# Altium project STM32.PrjPcb
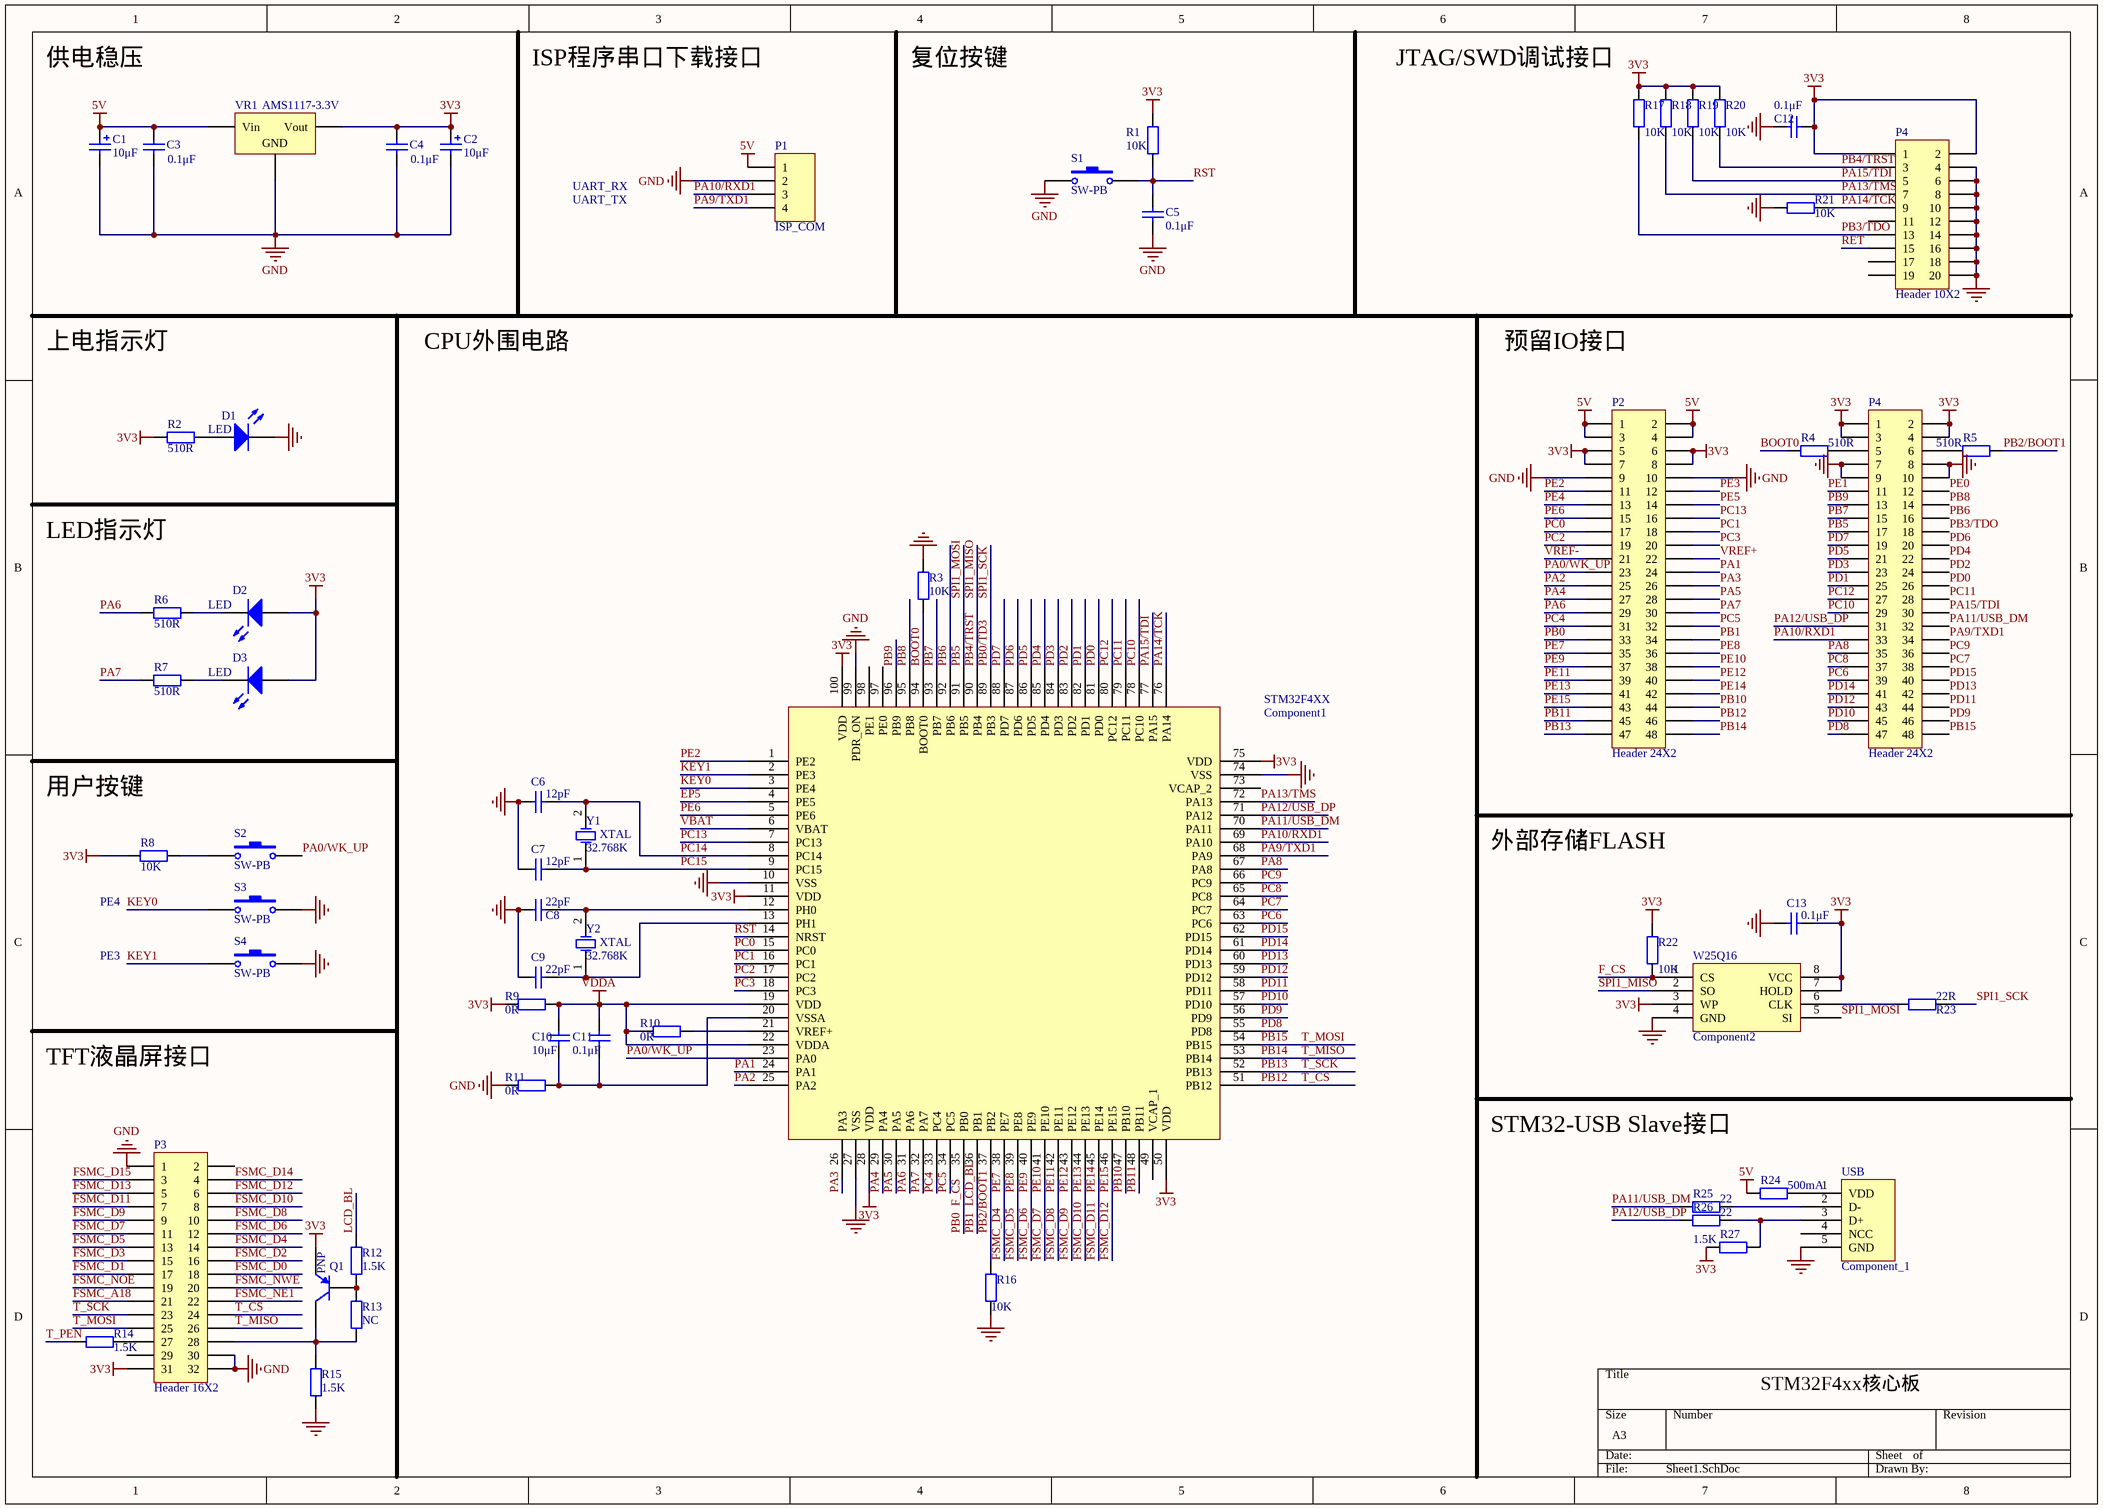
[diagram p0: Sheet1.SchDoc]
1 sheet, 59 parts. Net scope: global (net labels, ports and power ports of the same name join across sheets).
Board file: PCB1.PcbDoc

## Sheet Sheet1.SchDoc
size A3

### Parts
(Parts that share a designator on the sheet are numbered #1, #2 ... from top to bottom, then left to right.)
C1  value 10μF  [6-0805_M]  (hidden comment: Cap Pol2)
C2  value 10μF  [6-0805_M]  (hidden comment: Cap Pol2)
C3  value 0.1μF  [6-0805_M]  (hidden comment: Cap)
C4  value 0.1μF  [6-0805_M]  (hidden comment: Cap)
C5  value 0.1μF  [6-0805_M]  (hidden comment: Cap)
C6  value 12pF  [6-0805_M]  (hidden comment: Cap)
C7  value 12pF  [6-0805_M]  (hidden comment: Cap)
C8  value 22pF  [6-0805_M]  (hidden comment: Cap)
C9  value 22pF  [6-0805_M]  (hidden comment: Cap)
C10  value 10μF  [6-0805_M]  (hidden comment: Cap)
C11  value 0.1μF  [6-0805_M]  (hidden comment: Cap)
C12  value 0.1μF  [6-0805_M]  (hidden comment: Cap)
C13  value 0.1μF  [6-0805_M]  (hidden comment: Cap)
D1  LED  [6-0805_M]
D2  LED  [6-0805_M]
D3  LED  [6-0805_M]
P1  ISP_COM  [HDR1X4]
P2  Header 24X2  [HDR2X24]
P3  Header 16X2  [HDR2X16]
P4#1  Header 10X2  [HDR2X10]
P4#2  Header 24X2  [HDR2X24]
Q1  PNP  [SOT-23B_N]
R1  value 10K  [6-0805_M]  (hidden comment: Res2)
R2  value 510R  [6-0805_M]  (hidden comment: Res2)
R3  value 10K  [6-0805_M]  (hidden comment: Res2)
R4  value 510R  [6-0805_M]  (hidden comment: Res2)
R5  value 510R  [6-0805_M]  (hidden comment: Res2)
R6  value 510R  [6-0805_M]  (hidden comment: Res2)
R7  value 510R  [6-0805_M]  (hidden comment: Res2)
R8  value 10K  [6-0805_M]  (hidden comment: Res2)
R9  value 0R  [6-0805_M]  (hidden comment: Res2)
R10  value 0R  [6-0805_M]  (hidden comment: Res2)
R11  value 0R  [6-0805_M]  (hidden comment: Res2)
R12  value 1.5K  [6-0805_M]  (hidden comment: Res2)
R13  value NC  [6-0805_M]  (hidden comment: Res2)
R14  value 1.5K  [6-0805_M]  (hidden comment: Res2)
R15  value 1.5K  [6-0805_M]  (hidden comment: Res2)
R16  value 10K  [6-0805_M]  (hidden comment: Res2)
R17  value 10K  [6-0805_M]  (hidden comment: Res2)
R18  value 10K  [6-0805_M]  (hidden comment: Res2)
R19  value 10K  [6-0805_M]  (hidden comment: Res2)
R20  value 10K  [6-0805_M]  (hidden comment: Res2)
R21  value 10K  [6-0805_M]  (hidden comment: Res2)
R22  value 10K  [6-0805_M]  (hidden comment: Res2)
R23  value 22R  [6-0805_M]  (hidden comment: Res2)
R24  value 500mA  [6-0805_M]  (hidden comment: Res2)
R25  value 22  [6-0805_M]  (hidden comment: Res2)
R26  value 22  [6-0805_M]  (hidden comment: Res2)
R27  value 1.5K  [6-0805_M]  (hidden comment: Res2)
S1  SW-PB  [2029]
S2  SW-PB  [2029]
S3  SW-PB  [2029]
S4  SW-PB  [2029]
STM32F4XX  Component1  [STM32F4XX]
USB  Component_1  [USB]
VR1  AMS1117-3.3V  [SOT223_M]
W25Q16  Component2  [W25Q16]
Y1  XTAL  [R38]
Y2  XTAL  [R38]

### Nets
3V3: C2.1 C4.1 C12.2 C13.2 D2.1(A) D3.1(A) P2.5 P2.6 P2.7 P2.8 P3.31 P4#1.1 P4#1.2 P4#2.1 P4#2.2 P4#2.3 P4#2.4 Q1.3(E) R1.2 R2.2 R8.2 R9.1 R17.2 R18.2 R19.2 R20.2 R22.2 R27.1 STM32F4XX.11(VDD) STM32F4XX.28(VDD) STM32F4XX.50(VDD) STM32F4XX.75(VDD) STM32F4XX.100(VDD) VR1.3(Vout) W25Q16.3(WP) W25Q16.7(HOLD) W25Q16.8(VCC)
5V: C1.1 C3.2 P1.1 P2.1 P2.2 P2.3 P2.4 R24.1 VR1.1(Vin)
GND: C1.2 C2.2 C3.1 C4.2 C5.1 C6.1 C7.1 C8.1 C9.1 C12.1 C13.1 D1.2(K) P1.2 P2.9 P2.10 P3.1 P3.30 P3.32 P4#1.4 P4#1.6 P4#1.8 P4#1.10 P4#1.12 P4#1.14 P4#1.16 P4#1.18 P4#1.20 P4#2.7 P4#2.8 P4#2.9 P4#2.10 R3.2 R11.1 R15.1 R16.1 R21.1 S1.1 S3.2 S4.2 STM32F4XX.10(VSS) STM32F4XX.27(VSS) STM32F4XX.74(VSS) STM32F4XX.99(PDR_ON) USB.5(GND) VR1.2(GND) W25Q16.4(GND)
VDDA: C10.2 C11.2 R9.2 R10.1 STM32F4XX.19(VDD) STM32F4XX.22(VDDA)
BOOT0: R3.1 R4.1 STM32F4XX.94(BOOT0)
EP5: STM32F4XX.4(PE5)
F_CS: P2.33 R22.1 STM32F4XX.35(PB0) W25Q16.1(CS)  [also labelled PB0]
FSMC_A18: P3.21
FSMC_D0: P3.18
FSMC_D1: P3.17
FSMC_D2: P3.16
FSMC_D3: P3.15
FSMC_D4: P2.35 P3.14 STM32F4XX.38(PE7)  [also labelled PE7]
FSMC_D5: P2.36 P3.13 STM32F4XX.39(PE8)  [also labelled PE8]
FSMC_D6: P2.37 P3.12 STM32F4XX.40(PE9)  [also labelled PE9]
FSMC_D7: P2.38 P3.11 STM32F4XX.41(PE10)  [also labelled PE10]
FSMC_D8: P2.39 P3.10 STM32F4XX.42(PE11)  [also labelled PE11]
FSMC_D9: P2.40 P3.9 STM32F4XX.43(PE12)  [also labelled PE12]
FSMC_D10: P2.41 P3.8 STM32F4XX.44(PE13)  [also labelled PE13]
FSMC_D11: P2.42 P3.7 STM32F4XX.45(PE14)  [also labelled PE14]
FSMC_D12: P2.43 P3.6 STM32F4XX.46(PE15)  [also labelled PE15]
FSMC_D13: P3.5
FSMC_D14: P3.4
FSMC_D15: P3.3
FSMC_NE1: P3.22
FSMC_NOE: P3.19
FSMC_NWE: P3.20
KEY0: S3.1 STM32F4XX.3(PE4)
KEY1: S4.1 STM32F4XX.2(PE3)
LCD_BL: P2.34 R12.2 STM32F4XX.36(PB1)  [also labelled PB1]
PA0/WK_UP: P2.23 S2.2 STM32F4XX.23(PA0)
PA1: P2.24 STM32F4XX.24(PA1)
PA2: P2.25 STM32F4XX.25(PA2)
PA3: P2.26 STM32F4XX.26(PA3)
PA4: P2.27 STM32F4XX.29(PA4)
PA5: P2.28 STM32F4XX.30(PA5)
PA6: P2.29 R6.2 STM32F4XX.31(PA6)
PA7: P2.30 R7.2 STM32F4XX.32(PA7)
PA8: P4#2.35 STM32F4XX.67(PA8)
PA9/TXD1: P1.4 P4#2.34 STM32F4XX.68(PA9)
PA10/RXD1: P1.3 P4#2.33 STM32F4XX.69(PA10)
PA11/USB_DM: P4#2.32 R25.1 STM32F4XX.70(PA11)
PA12/USB_DP: P4#2.31 R26.1 STM32F4XX.71(PA12)
PA13/TMS: P4#1.7 R18.1 STM32F4XX.72(PA13)
PA14/TCK: P4#1.9 R21.2 STM32F4XX.76(PA14)
PA15/TDI: P4#1.5 P4#2.30 R19.1 STM32F4XX.77(PA15)
PB0/TD3: R23.2 STM32F4XX.89(PB3)  [also labelled SPI1_SCK]
PB2/BOOT1: R5.2 R16.2 STM32F4XX.37(PB2)
PB3/TDO: P4#1.13 P4#2.18 R17.1
PB4/TRST: P4#1.3 R20.1 STM32F4XX.90(PB4) W25Q16.2(SO)  [also labelled SPI1_MISO]
PB5: P4#2.17 STM32F4XX.91(PB5) W25Q16.5(SI)  [also labelled SPI1_MOSI]
PB6: P4#2.16 STM32F4XX.92(PB6)
PB7: P4#2.15 STM32F4XX.93(PB7)
PB8: P4#2.14 STM32F4XX.95(PB8)
PB9: P4#2.13 STM32F4XX.96(PB9)
PB10: P2.44 STM32F4XX.47(PB10)
PB11: P2.45 STM32F4XX.48(PB11)
PB12: P2.46 P3.24 STM32F4XX.51(PB12)  [also labelled T_CS]
PB13: P2.47 P3.23 STM32F4XX.52(PB13)  [also labelled T_SCK]
PB14: P2.48 P3.26 STM32F4XX.53(PB14)  [also labelled T_MISO]
PB15: P3.25 P4#2.48 STM32F4XX.54(PB15)  [also labelled T_MOSI]
PC0: P2.17 STM32F4XX.15(PC0)
PC1: P2.18 STM32F4XX.16(PC1)
PC2: P2.19 STM32F4XX.17(PC2)
PC3: P2.20 STM32F4XX.18(PC3)
PC4: P2.31 STM32F4XX.33(PC4)
PC5: P2.32 STM32F4XX.34(PC5)
PC6: P4#2.39 STM32F4XX.63(PC6)
PC7: P4#2.38 STM32F4XX.64(PC7)
PC8: P4#2.37 STM32F4XX.65(PC8)
PC9: P4#2.36 STM32F4XX.66(PC9)
PC10: P4#2.29 STM32F4XX.78(PC10)
PC11: P4#2.28 STM32F4XX.79(PC11)
PC12: P4#2.27 STM32F4XX.80(PC12)
PC13: P2.16 STM32F4XX.7(PC13)
PC14: C6.2 STM32F4XX.8(PC14) Y1.2(OSC2)
PC15: C7.2 STM32F4XX.9(PC15) Y1.1(OSC1)
PD0: P4#2.26 STM32F4XX.81(PD0)
PD1: P4#2.25 STM32F4XX.82(PD1)
PD2: P4#2.24 STM32F4XX.83(PD2)
PD3: P4#2.23 STM32F4XX.84(PD3)
PD4: P4#2.22 STM32F4XX.85(PD4)
PD5: P4#2.21 STM32F4XX.86(PD5)
PD6: P4#2.20 STM32F4XX.87(PD6)
PD7: P4#2.19 STM32F4XX.88(PD7)
PD8: P4#2.47 STM32F4XX.55(PD8)
PD9: P4#2.46 STM32F4XX.56(PD9)
PD10: P4#2.45 STM32F4XX.57(PD10)
PD11: P4#2.44 STM32F4XX.58(PD11)
PD12: P4#2.43 STM32F4XX.59(PD12)
PD13: P4#2.42 STM32F4XX.60(PD13)
PD14: P4#2.41 STM32F4XX.61(PD14)
PD15: P4#2.40 STM32F4XX.62(PD15)
PE0: P4#2.12
PE1: P4#2.11
PE2: P2.11 STM32F4XX.1(PE2)
PE3: P2.12
PE4: P2.13
PE5: P2.14
PE6: P2.15 STM32F4XX.5(PE6)
RET: P4#1.15
RST: C5.2 R1.1 S1.2 STM32F4XX.14(NRST)
T_PEN: R14.1
VBAT: STM32F4XX.6(VBAT)
VREF+: P2.22
VREF-: P2.21
NetC8_2: C8.2 STM32F4XX.12(PH0) Y2.2(OSC2)
NetC9_2: C9.2 STM32F4XX.13(PH1) Y2.1(OSC1)
NetC10_1: C10.1 C11.1 R11.2 STM32F4XX.20(VSSA)
NetD1_1: D1.1(A) R2.1
NetD2_2: D2.2(K) R6.1
NetD3_2: D3.2(K) R7.1
NetP3_27: P3.27 R14.2
NetP3_28: P3.28 Q1.1(C) R13.1 R15.2
NetP4#2_5: P4#2.5 R4.2
NetP4#2_6: P4#2.6 R5.1
NetQ1_2: Q1.2(B) R12.1 R13.2
NetR8_1: R8.1 S2.1
NetR10_2: R10.2 STM32F4XX.21(VREF+)
NetR23_1: R23.1 W25Q16.6(CLK)
NetR24_2: R24.2 USB.1(VDD)
NetR25_2: R25.2 USB.2(D-)
NetR26_2: R26.2 R27.2 USB.3(D+)

Not connected (* = marked no-connect by the designer): P3 2 29; P4#1 11 17 19; STM32F4XX 49(VCAP_1) 73(VCAP_2) 97(PE0) 98(PE1); USB 4(NCC)

### Notes on the sheet
- 供电稳压
- ISP程序串口下载接口
- 复位按键
- JTAG/SWD调试接口
- UART_RX
- UART_TX
- 上电指示灯
- CPU外围电路
- 预留IO接口
- LED指示灯
- 用户按键
- 外部存储FLASH
- (near R8) PE4
- PE3
- TFT液晶屏接口
- STM32-USB Slave接口
- STM32F4xx核心板
- (in symbol XTAL) 32.768K

### Library data of the parts
C1 C2 = Cap Pol2: Polarized Capacitor (Axial); Published: 8-Jun-2000; LatestRevisionDate: 17-Jul-2002; LatestRevisionNote: Re-released for DXP Platform.; PackageReference: POLAR0.8; Publisher: Altium Limited; PackageDescription: Polarized Capacitor; 2 Leads
C3-C13 = Cap: Capacitor; Published: 8-Jun-2000; LatestRevisionDate: 17-Jul-2002; LatestRevisionNote: Re-released for DXP Platform.; PackageReference: RAD-0.3; Publisher: Altium Limited; PackageDescription: Radial Cap, Thru-Hole; 2 Leads; 0.3 in Pin Spacing
D1-D3 = LED0: Typical INFRARED GaAs LED; Published: 8-Jun-2000; LatestRevisionDate: 08-Jul-2005; LatestRevisionNote: Mech Layer 1 removed.; PackageReference: LED-0; Publisher: Altium Limited; PackageDescription: LED; 2 Leads
P1 = Header 4: Header, 4-Pin; LatestRevisionDate: 17-Jul-2002; LatestRevisionNote: Re-released for DXP Platform.; Publisher: Altium Limited
P2 P4#2 = Header 24X2: Header, 24-Pin, Dual row; LatestRevisionDate: 17-Jul-2002; LatestRevisionNote: Re-released for DXP Platform.; Publisher: Altium Limited
P3 = Header 16X2: Header, 16-Pin, Dual row; LatestRevisionDate: 17-Jul-2002; LatestRevisionNote: Re-released for DXP Platform.; Publisher: Altium Limited
P4#1 = Header 10X2: Header, 10-Pin, Dual row; LatestRevisionDate: 17-Jul-2002; LatestRevisionNote: Re-released for DXP Platform.; Publisher: Altium Limited
Q1 = PNP: PNP Bipolar Transistor; Published: 8-Jun-2000; LatestRevisionDate: 29-May-2009; LatestRevisionNote: IPC-7351 Footprint Added.; PackageVersion: Aug-1999; PackageReference: SOT-23B; Publisher: Altium Limited; PackageDescription: 3-Pin SOT-23 Package 0.95 mm Pitch, 2.4 mm Lead Span
R1-R27 = Res2: Resistor; Published: 8-Jun-2000; LatestRevisionDate: 17-Jul-2002; LatestRevisionNote: Re-released for DXP Platform.; PackageReference: AXIAL-0.4; Publisher: Altium Limited; PackageDescription: Axial Device, Thru-Hole; 2 Leads; 0.4 in Pin Spacing
S1-S4 = SW-PB: Switch; Published: 24-Mar-1999; LatestRevisionDate: 17-Jul-2002; LatestRevisionNote: Re-released for DXP Platform.; PackageReference: SPST-2; Publisher: Altium Limited; PackageDescription: Switch; 2 Leads
VR1 = Volt Reg: Voltage Regulator; Published: 24-Mar-1999; LatestRevisionDate: 29-May-2009; LatestRevisionNote: IPC-7351 Footprint Added.; PackageReference: D2PAK; Publisher: Altium Limited; PackageDescription: 3-Pin Transistor Outline Package 2.54 mm Pitch, 15.1 mm Lead Span
Y1 Y2 = XTAL: Crystal Oscillator; Published: 8-Jun-2000; LatestRevisionDate: 17-Jul-2002; LatestRevisionNote: Re-released for DXP Platform.; PackageReference: R38; Publisher: Altium Limited; PackageDescription: Crystal, Thru-Hole; 2 Leads; Body 3.1 x 8.2 mm (Dia.xH)